# EAGLE design RaspberryPi-breakout (EAGLE 6.6.0)
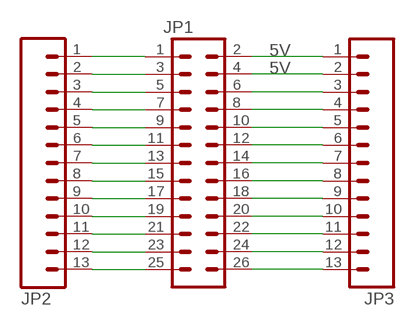
[diagram p0: schematic, sheet 1]

## Parts
JP1  M13X22X13  [2X13]
JP2  M13  [1X13]
JP3  M13  [1X13]

## Nets
N$1: JP1.2 JP3.1
N$2: JP1.4 JP3.2
N$3: JP1.6 JP3.3
N$4: JP1.8 JP3.4
N$5: JP1.10 JP3.5
N$6: JP1.12 JP3.6
N$7: JP1.14 JP3.7
N$8: JP1.16 JP3.8
N$9: JP1.18 JP3.9
N$10: JP1.20 JP3.10
N$11: JP1.22 JP3.11
N$12: JP1.24 JP3.12
N$13: JP1.26 JP3.13
N$14: JP1.25 JP2.13
N$15: JP1.23 JP2.12
N$16: JP1.21 JP2.11
N$17: JP1.19 JP2.10
N$18: JP1.17 JP2.9
N$19: JP1.15 JP2.8
N$20: JP1.13 JP2.7
N$21: JP1.11 JP2.6
N$22: JP1.9 JP2.5
N$23: JP1.7 JP2.4
N$24: JP1.5 JP2.3
N$25: JP1.3 JP2.2
N$26: JP1.1 JP2.1

## Notes on the sheet
- 5V
- 5V

## Library data of the parts
JP1 = SparkFun-Connectors:M13X2: 0.1" spaced headers
JP2 JP3 = SparkFun-Connectors:M13: 13-pin single row .1" header

## Board
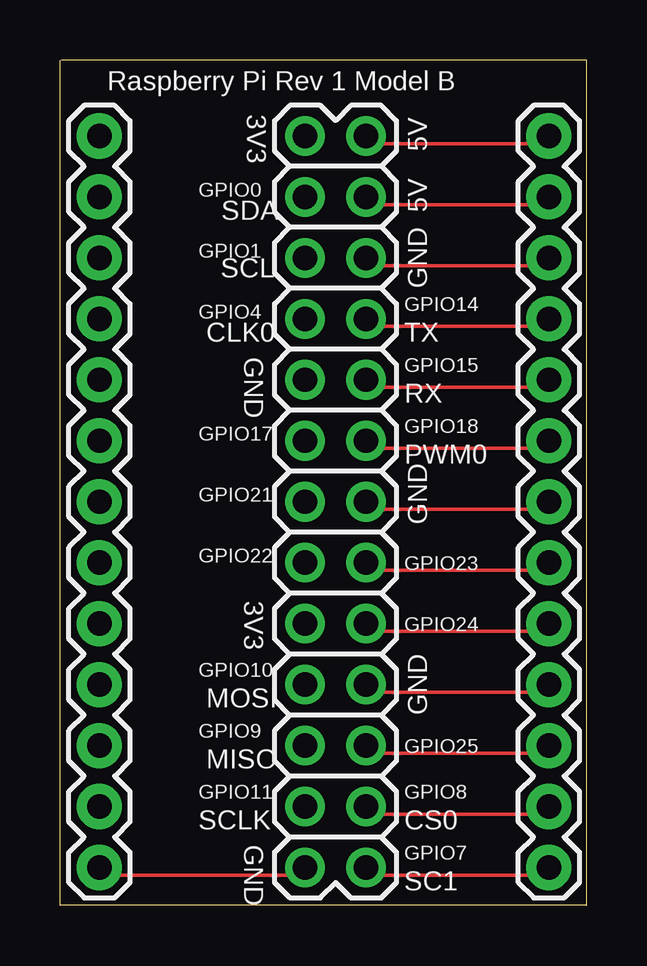
[diagram p1: board, top side]
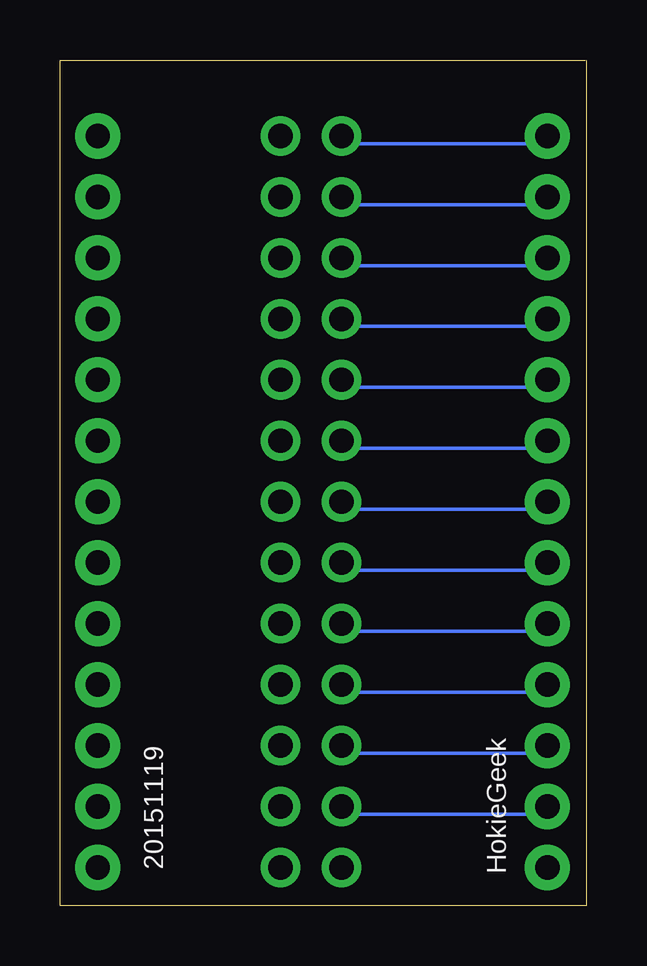
[diagram p2: board, bottom side, seen from below]

Size 21.95 x 35.23 mm. Coordinates in mm from the lower left corner, seen from the top.
Outline: 21.95,0 21.95,35.23 0.05,35.23
Outline: 0,0 0,35.23
Outline: 21.91,0.01 0.01,0.01
Copper layers (1*16): Top 0.0356mm / dielectric 1.5011mm / Bottom 0.0356mm
Design rules "LaenPCBOrder": minimum track width 6mil, minimum drill 13mil, track to track 6mil, track to pad 6mil, pad to pad 6mil, via to via 6mil, smd to smd 6mil, copper to edge 15mil, drill to drill 6mil, minimum pad ring 7mil, minimum via ring 7mil, stop-mask expansion 3mil, vias tented up to drill 0mil, thermal gap 10mil

### Footprints (pad centres in the part's own frame; a part is rotated, then mirrored left to right if it is on the bottom)
2X13 = drill 1.016 pad 1.651: 1 0,0; 2 0,2.54; 3 2.54,0; 4 2.54,2.54; 5 5.08,0; 6 5.08,2.54; 7 7.62,0; 8 7.62,2.54; 9 10.16,0; 10 10.16,2.54; 11 12.7,0; 12 12.7,2.54; 13 15.24,0; 14 15.24,2.54; 15 17.78,0; 16 17.78,2.54; 17 20.32,0; 18 20.32,2.54; 19 22.86,0; 20 22.86,2.54; 21 25.4,0; 22 25.4,2.54; 23 27.94,0; 24 27.94,2.54; 25 30.48,0; 26 30.48,2.54
1X13 = drill 1.016 pad 1.88: 1 0,0; 2 2.54,0; 3 5.08,0; 4 7.62,0; 5 10.16,0; 6 12.7,0; 7 15.24,0; 8 17.78,0; 9 20.32,0; 10 22.86,0; 11 25.4,0; 12 27.94,0; 13 30.48,0

### Placement (x,y rotation side)
JP1  10.21,32.07 270 top
JP2  1.64,32.07 270 top
JP3  20.37,32.07 270 top

### Tracks (layer width: path | path; a pad name or v marks a point on that pad's centre or on a via)
N$1
  Top 0.152: JP1.2 12.75,31.75 20.37,31.75 JP3.1
N$2
  Top 0.152: JP1.4 12.75,29.21 20.37,29.21 JP3.2
N$3
  Top 0.152: JP1.6 12.75,26.67 20.37,26.67 JP3.3
N$4
  Top 0.152: JP1.8 12.75,24.13 20.37,24.13 JP3.4
N$5
  Top 0.152: JP1.10 12.75,21.59 20.37,21.59 JP3.5
N$6
  Top 0.152: JP1.12 12.75,19.05 20.37,19.05 JP3.6
N$7
  Top 0.152: JP1.14 12.75,16.51 20.37,16.51 JP3.7
N$8
  Top 0.152: JP1.16 12.75,13.97 20.37,13.97 JP3.8
N$9
  Top 0.152: JP1.18 12.75,11.43 20.37,11.43 JP3.9
N$10
  Top 0.152: JP1.20 12.75,8.89 20.37,8.89 JP3.10
N$11
  Top 0.152: JP1.22 12.75,6.35 20.37,6.35 JP3.11
N$12
  Top 0.152: JP1.24 12.75,3.81 20.37,3.81 JP3.12
N$13
  Top 0.152: JP1.26 12.75,1.27 20.37,1.27 JP3.13
N$14
  Top 0.152: JP1.25 10.21,1.27 1.32,1.27 JP2.13
N$15
  Bottom 0.152: JP1.23 10.21,3.81 1.32,3.81 JP2.12
N$16
  Bottom 0.152: JP1.21 10.21,6.35 1.32,6.35 JP2.11
N$17
  Bottom 0.152: JP1.19 10.21,8.89 1.32,8.89 JP2.10
N$18
  Bottom 0.152: JP1.17 10.21,11.43 1.32,11.43 JP2.9
N$19
  Bottom 0.152: JP1.15 10.21,13.97 1.32,13.97 JP2.8
N$20
  Bottom 0.152: JP1.13 10.21,16.51 1.32,16.51 JP2.7
N$21
  Bottom 0.152: JP1.11 10.21,19.05 1.32,19.05 JP2.6
N$22
  Bottom 0.152: JP1.9 10.21,21.59 1.32,21.59 JP2.5
N$23
  Bottom 0.152: JP1.7 10.21,24.13 1.32,24.13 JP2.4
N$24
  Bottom 0.152: JP1.5 10.21,26.67 1.32,26.67 JP2.3
N$25
  Bottom 0.152: JP1.3 10.21,29.21 1.32,29.21 JP2.2
N$26
  Bottom 0.152: JP1.1 10.21,31.75 1.32,31.75 JP2.1

### Text on the board
tPlace: Raspberry Pi Rev 1 Model B | 3V3 | 5V | GPIO0 | SDA | 5V | GPIO1 | SCL | GND | GPIO14 | GPIO4 | CLK0 | GND | TX | GPIO15 | RX | GPIO18 | GPIO17 | PWM0 | GPIO21 | GND | GPIO22 | GPIO23 | 3V3 | GPIO24 | GPIO10 | MOSI | GND | GPIO9 | MISO | GPIO25 | GPIO11 | GPIO8 | SCLK | GND | CS0 | GPIO7 | SC1
bPlace: HokieGeek | 20151119